# Altium schematic sheet Sheet5.SchDoc
size A4
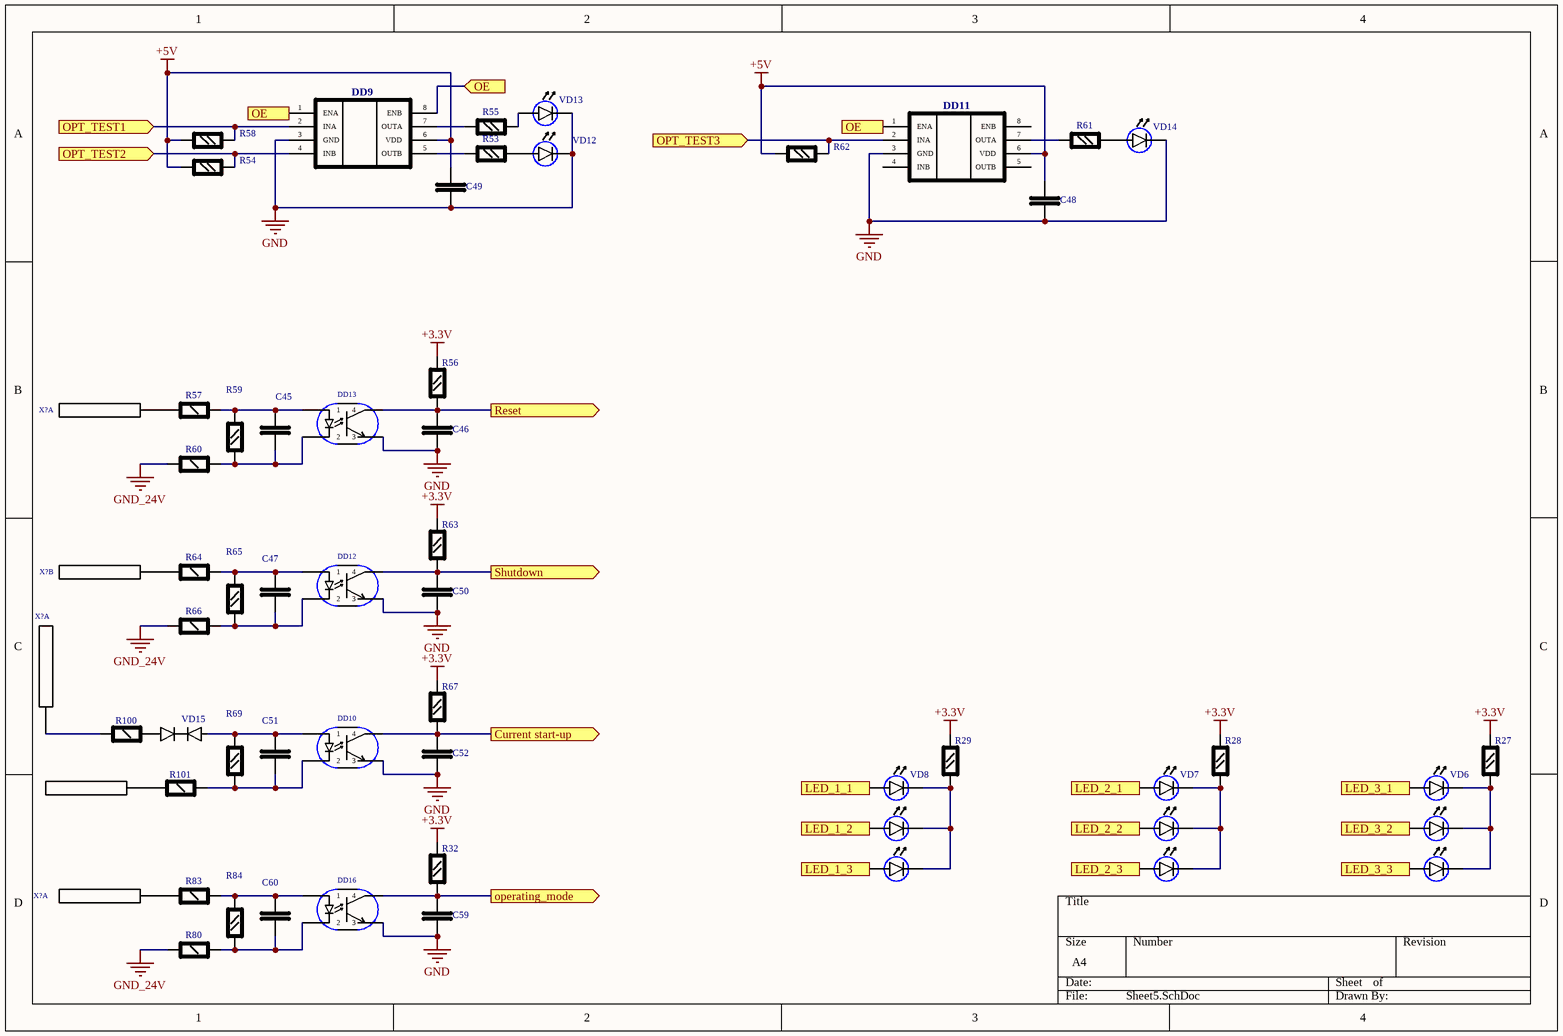
[diagram p0: Sheet5.SchDoc]

## Parts
(Parts that share a designator on the sheet are numbered #1, #2 ... from top to bottom, then left to right.)
C45  CAP_0805  [CAP_0805]  (value not drawn)
C46  CAP_0805  [CAP_0805]  (value not drawn)
C47  CAP_0805  [CAP_0805]  (value not drawn)
C48  CAP_0805  [CAP_0805]  (value not drawn)
C49  CAP_0805  [CAP_0805]  (value not drawn)
C50  CAP_0805  [CAP_0805]  (value not drawn)
C51  CAP_0805  [CAP_0805]  (value not drawn)
C52  CAP_0805  [CAP_0805]  (value not drawn)
C59  CAP_0805  [CAP_0805]  (value not drawn)
C60  CAP_0805  [CAP_0805]  (value not drawn)
DD9  UCC27423  [SO8]  (value not drawn)
DD10  HMA2701  [HMA2701_HMA2701(Primary)]  (value not drawn)
DD11  UCC27423  [SO8]  (value not drawn)
DD12  HMA2701  [HMA2701_HMA2701(Primary)]  (value not drawn)
DD13  HMA2701  [HMA2701_HMA2701(Primary)]  (value not drawn)
DD16  HMA2701  [HMA2701_HMA2701(Primary)]  (value not drawn)
R27  RES_0805  [RES_0805]  (value not drawn)
R28  RES_0805  [RES_0805]  (value not drawn)
R29  RES_0805  [RES_0805]  (value not drawn)
R32  RES_0805  [RES_0805]  (value not drawn)
R53  RES_0805  [RES_0805]  (value not drawn)
R54  RES_0805  [RES_0805]  (value not drawn)
R55  RES_0805  [RES_0805]  (value not drawn)
R56  RES_0805  [RES_0805]  (value not drawn)
R57  RES_1206  [RES_1206]  (value not drawn)
R58  RES_0805  [RES_0805]  (value not drawn)
R59  RES_0805  [RES_0805]  (value not drawn)
R60  RES_1206  [RES_1206]  (value not drawn)
R61  RES_0805  [RES_0805]  (value not drawn)
R62  RES_0805  [RES_0805]  (value not drawn)
R63  RES_0805  [RES_0805]  (value not drawn)
R64  RES_1206  [RES_1206]  (value not drawn)
R65  RES_0805  [RES_0805]  (value not drawn)
R66  RES_1206  [RES_1206]  (value not drawn)
R67  RES_0805  [RES_0805]  (value not drawn)
R69  RES_0805  [RES_0805]  (value not drawn)
R80  RES_1206  [RES_1206]  (value not drawn)
R83  RES_1206  [RES_1206]  (value not drawn)
R84  RES_0805  [RES_0805]  (value not drawn)
R100  R_025W  [RES_025W]  (value not drawn)
R101  R_025W  [RES_025W]  (value not drawn)
VD6  VDR_V  [LED1_VDR_V(Primary)]  (value not drawn)
VD7  VDR_V  [LED1_VDR_V(Primary)]  (value not drawn)
VD8  VDR_V  [LED1_VDR_V(Primary)]  (value not drawn)
VD12  VDR_V  [LED1_VDR_V(Primary)]  (value not drawn)
VD13  VDR_V  [LED1_VDR_V(Primary)]  (value not drawn)
VD14  VDR_V  [LED1_VDR_V(Primary)]  (value not drawn)
VD15  VD_GORIZONT  [BYM1001]  (value not drawn)
VD?#1  VD_GORIZONT  [BYM1001]  (value not drawn)
VD?#2  VDR_V  [LED1_VDR_V(Primary)]  (value not drawn)
VD?#3  VDR_V  [LED1_VDR_V(Primary)]  (value not drawn)
VD?#4  VDR_V  [LED1_VDR_V(Primary)]  (value not drawn)
VD?#5  VDR_V  [LED1_VDR_V(Primary)]  (value not drawn)
VD?#6  VDR_V  [LED1_VDR_V(Primary)]  (value not drawn)
VD?#7  VDR_V  [LED1_VDR_V(Primary)]  (value not drawn)
X?#1  DFK-MSTBA2.5/2-GF-5.08  [DFK_MSTBA2_ALL]  (value not drawn)  (part A of 2)
X?#2  DFK-MSTBA2.5/2-GF-5.08  [DFK_MSTBA2_ALL]  (value not drawn)  (part B of 2)
X?#3  DFK-MSTBA2.5/2-GF-5.08  [DFK_MSTBA2_ALL]  (value not drawn)  (part A of 2)
X?#4  DFK-MSTBA2.5/3-GF-5.08  [DFK_MSTBA3_ALL]  (value not drawn)  (part A of 3)
XB  DFK-MSTBA2.5/2-GF-5.08  [DFK_MSTBA2_ALL]  (value not drawn)  (part A of 2)

## Ports
Current start-up (out), LED_1_1 (in), LED_1_2 (in), LED_1_3 (in), LED_2_1 (in), LED_2_2 (in), LED_2_3 (in), LED_3_1 (in), LED_3_2 (in), LED_3_3 (in), OE (in), operating_mode (out), OPT_TEST1 (in), OPT_TEST2 (in), OPT_TEST3 (in), Reset (out), Shutdown (out)

## Nets
+3.3V: R27.2(D2) R28.2(D2) R29.2(D2) R32.2(D2) R56.2(D2) R63.2(D2) R67.2(D2)
+5V: C48.2(D2) C49.2(D2) DD9.6(VDD) DD11.6(VDD) R54.1(D1) R58.1(D1) R62.1(D1)
GND: C46.1(D1) C48.1(D1) C49.1(D1) C50.1(D1) C52.1(D1) C59.1(D1) DD9.3(GND) DD10.Emitter(3) DD11.3(GND) DD12.Emitter(3) DD13.Emitter(3) DD16.Emitter(3) VD12.C VD13.C VD14.C
GND_24V: R60.1(D1) R66.1(D1) R80.1(D1)
Current start-up: C52.2(D2) DD10.Collector(4) R67.1(D1) ; port Current start-up
LED_1_1: VD8.A ; port LED_1_1
LED_1_2: VD?#2.A ; port LED_1_2
LED_1_3: VD?#5.A ; port LED_1_3
LED_2_1: VD7.A ; port LED_2_1
LED_2_2: VD?#3.A ; port LED_2_2
LED_2_3: VD?#6.A ; port LED_2_3
LED_3_1: VD6.A ; port LED_3_1
LED_3_2: VD?#4.A ; port LED_3_2
LED_3_3: VD?#7.A ; port LED_3_3
OE: DD9.1(ENA) DD9.8(ENB) DD11.1(ENA) ; port OE
operating_mode: C59.2(D2) DD16.Collector(4) R32.1(D1) ; port operating_mode
OPT_TEST1: DD9.2(INA) R58.2(D2) ; port OPT_TEST1
OPT_TEST2: DD9.4(INB) R54.2(D2) ; port OPT_TEST2
OPT_TEST3: DD11.2(INA) R62.2(D2) ; port OPT_TEST3
Reset: C46.2(D2) DD13.Collector(4) R56.1(D1) ; port Reset
Shutdown: C50.2(D2) DD12.Collector(4) R63.1(D1) ; port Shutdown
NetC45_1: C45.1(D1) DD13.Cathod(2) R59.1(D1) R60.2(D2)
NetC45_2: C45.2(D2) DD13.Anod(1) R57.2(D2) R59.2(D2)
NetC47_1: C47.1(D1) DD12.Cathod(2) R65.1(D1) R66.2(D2)
NetC47_2: C47.2(D2) DD12.Anod(1) R64.2(D2) R65.2(D2)
NetC51_1: C51.1(D1) DD10.Cathod(2) R69.1(D1) R101.2(D2)
NetC51_2: C51.2(D2) DD10.Anod(1) R69.2(D2) VD15.2(D2)
NetC60_1: C60.1(D1) DD16.Cathod(2) R80.2(D2) R84.1(D1)
NetC60_2: C60.2(D2) DD16.Anod(1) R83.2(D2) R84.2(D2)
NetDD9_5: DD9.5(OUTB) R53.1(D1)
NetDD9_7: DD9.7(OUTA) R55.1(D1)
NetDD11_7: DD11.7(OUTA) R61.1(D1)
NetR27_1: R27.1(D1) VD6.C VD?#4.C VD?#7.C
NetR28_1: R28.1(D1) VD7.C VD?#3.C VD?#6.C
NetR29_1: R29.1(D1) VD8.C VD?#2.C VD?#5.C
NetR53_2: R53.2(D2) VD12.A
NetR55_2: R55.2(D2) VD13.A
NetR57_1: R57.1(D1) X?#1.1
NetR61_2: R61.2(D2) VD14.A
NetR64_1: R64.1(D1) X?#2.2
NetR83_1: R83.1(D1) X?#4.1
NetR100_1: R100.1(D1) X?#3.1
NetR100_2: R100.2(D2) VD?#1.2(D2)
NetR101_1: R101.1(D1) XB.1
NetVD15_1: VD15.1(D1) VD?#1.1(D1)

Not connected (* = marked no-connect by the designer): DD11 4(INB) 5(OUTB) 8(ENB); X?#1 3 4; X?#2 3 4; X?#3 3 4; X?#4 4 5; XB 3 4

## Library data of the parts
C45-C52 C59 C60 = CAP_0805: Value: *
DD9 DD11 = UCC27423: Value: *
DD10 DD12 DD13 DD16 = HMA2701: Value: *
R27-R29 R32 R53-R56 R58 R59 R61-R63 R65 R67 R69 R84 = RES_0805: Value: *
R57 R60 R64 R66 R80 R83 = RES_1206: Value: *
R100 R101 = R_025W: Value: *
VD6-VD8 VD12-VD14 VD?#2-VD?#7 = VDR_V: Value: *
VD15 VD?#1 = VD_GORIZONT: Value: *
X?#1-X?#3 XB = DFK-MSTBA2.5/2-GF-5.08: Value: *
X?#4 = DFK-MSTBA2.5/3-GF-5.08: Value: *